# Altium schematic sheet power_supply.SchDoc: Power Supply
size 297 x 209 mm; DrawnBy: TW
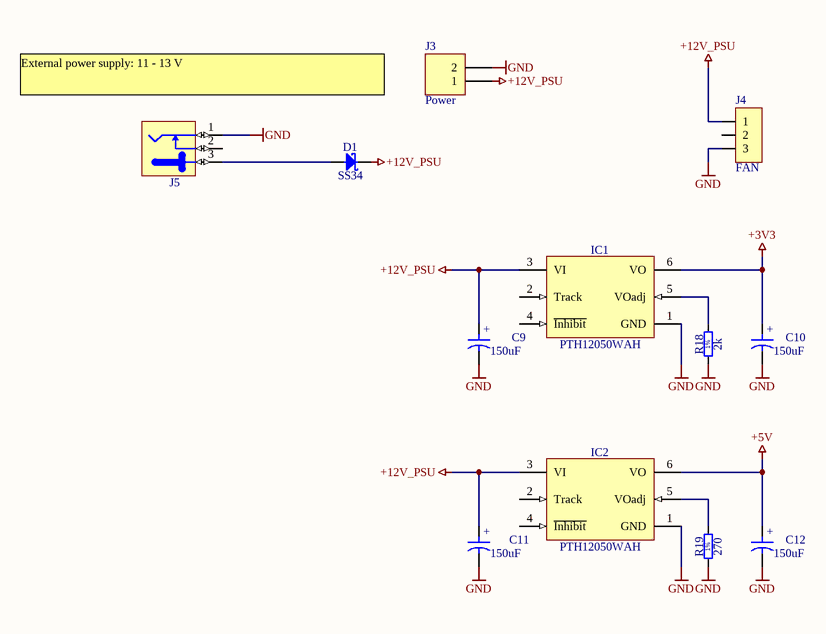
[diagram p0: power_supply.SchDoc]

## Parts
C9  150uF  [CAPPR500-1050X800]
C10  150uF  [CAPPR350-850X700]
C11  150uF  [CAPPR500-1050X800]
C12  150uF  [CAPPR350-850X700]
D1  SS34  [DIOM7659X265N]
IC1  PTH12050WAH  [TEXAS_EUU (R-PDSS-T6)]
IC2  PTH12050WAH  [TEXAS_EUU (R-PDSS-T6)]
J3  Power  [CON_3.96_2]
J4  FAN  [SIP3]
J5  Jack  [LUMBERG_161314]  (value not drawn)
R18  2k  [RESC2012X60N]
R19  270  [RESC2012X60N]

## Nets
+3V3: C10.1 IC1.6(VO)
+5V: C12.1 IC2.6(VO)
+12V_PSU: C9.1 C11.1 D1.1(C) IC1.3(VI) IC2.3(VI) J3.1 J4.1
GND: C9.2 C10.2 C11.2 C12.2 IC1.1(GND) IC2.1(GND) J3.2 J4.3 J5.1 R18.1 R19.1
NetD1_2: D1.2(A) J5.3
NetIC1_5: IC1.5(VOadj) R18.2
NetIC2_5: IC2.5(VOadj) R19.2

Not connected (* = marked no-connect by the designer): IC1 2(Track) 4(~{Inhibit}); IC2 2(Track) 4(~{Inhibit}); J4 2; J5 2

## Notes on the sheet
- (near J5) External power supply: 11 - 13 V
- Project/Equipment
- Document
- Designer
- Drawn by
- Check.by
- File
- Last Mod.
- Print Date
- Sheet
- Size
- A4
- of
- Rev
- (in symbol CAER_150UF_6.3V_20%_SANYO_6SEQP150M) +
- (in symbol CAER_150UF_16V_20%_SANYO_16SEQP150M) +
- (in symbol R0805_2K_1%_0.125W_100PPM) 1%
- (in symbol R0805_270R_1%_0.125W_100PPM) 1%

## Library data of the parts
C9 C11 = CAER_150UF_16V_20%_SANYO_16SEQP150M: Polarised capacitor; Part Description: Aluminium Solid Capacitor With Conductive Polymer (SEQP Serie); Manufacturer: SANYO OS-CON; Voltage: 16V; Tolerance: ±20%; Table: Capacitors THD; Part Number: CAER_150UF_16V_20%_SANYO_16SEQP150M; Component Kind: Standard; Component Type: Standard; Pin Count: 2; Value: 150uF; Status: Not Recommended; Manufacturer Part Number: 16SEQP150M; Case: LS5 D10 x H8; Mounted: Yes; Socket: No; SMD: No; ComponentHeight: 8mm; HelpURL: \\cern.ch\dfs\Applications\Altium\Datasheets\CAER_SANYO_SEQP.pdf; Author: CERN DEM JLC; CreateDate: 3/7/2011; LatestRevisionDate: 3/7/2011
C10 C12 = CAER_150UF_6.3V_20%_SANYO_6SEQP150M: Polarised capacitor; Part Description: Aluminium Solid Capacitor With Conductive Polymer (SEQP Serie); Manufacturer: SANYO OS-CON; Voltage: 6.3V; Tolerance: ±20%; Table: Capacitors THD; Part Number: CAER_150UF_6.3V_20%_SANYO_6SEQP150M; Component Kind: Standard; Component Type: Standard; Pin Count: 2; Value: 150uF; Status: Not Recommended; Manufacturer Part Number: 6SEQP150M; Case: LS3.5 D8 x H7; Mounted: Yes; Socket: No; SMD: No; ComponentHeight: 7mm; HelpURL: \\cern.ch\dfs\Applications\Altium\Datasheets\CAER_SANYO_SEQP.pdf; Author: CERN DEM JLC; CreateDate: 3/7/2011; LatestRevisionDate: 3/7/2011
D1 = SS34: Schottky Diode; Part Description: Surface Mount Schottky Barrier Rectifier; Manufacturer: FAIRCHILD SEMICONDUCTOR; Voltage: 40V; Power: 3A; Table: Diodes; Part Number: SS34; Component Kind: Standard; Component Type: Standard; Device: SS34; PackageDescription: DO-214-AB/SMC Molded Diode, Body 7.95x5.9mm, IPC Medium Density; Manufacturer Part Number: SS34; Pin Count: 2; Case: DO-214AC; Mounted: Yes; Socket: No; SMD: Yes; ComponentHeight: 2.65mm; HelpURL: \\cern.ch\dfs\Applications\Altium\Datasheets\SS34.pdf; Author: CERN DEM JLC; CreateDate: 8/23/2010; LatestRevisionDate: 8/23/2010
IC1 IC2 = PTH12050WAH: 6-A, 12-V Input, Non-Isolated, Wide-Output 1.2V to 5.5V, Adjustable Power Modue; Part Description: 6A, 12-V Input, Non-Isolated, Wide-Output 1.2V to 5.5V, Adjustable Power Module; Manufacturer: TEXAS INSTRUMENTS; Table: Regulators; Part Number: PTH12050WAH; Component Kind: Standard; Component Type: Standard; Device: PTH12050WAH; PackageDescription: Texas TEXAS_EUU (R-PDSS-T6) Case; Manufacturer Part Number: PTH12050WAH; Pin Count: 6; Mounted: Yes; Socket: No; SMD: No; ComponentHeight: 8.5mm; HelpURL: \\cern.ch\dfs\Applications\Altium\Datasheets\PTH12050WAH.pdf; Author: CERN DEM JLC; CreateDate: 7/7/2010; LatestRevisionDate: 7/7/2010
J3 = Header 2: Header, 2-Pin; LatestRevisionDate: 17-Jul-2002; LatestRevisionNote: Re-released for DXP Platform.; Publisher: Altium Limited
J4 = CON3: Connector
J5 = LUMBERG_161314: 24V /3. 5A, 2.1mm Diameter Pin, SMD DC Power Supply Connector With  Break Contact; Manufacturer Part Number: 161314; Table: Miscellaneous; Part Number: LUMBERG_161314; Component Kind: Standard; Component Type: Standard; Pin Count: 3; Family: Jack; Mounted: Yes; Socket: No; SMD: No; Status: None; Part Description: 24V/3. 5A, 2.1mm Diameter Pin, SMD DC Power Supply Connector With  Break Contact; Manufacturer: LUMBERG; ComponentHeight: 11mm; HelpURL: \\cern.ch\dfs\Applications\Altium\Datasheets\LUMBERG_161314.pdf; Author: CERN DEM JLC; CreateDate: 2/15/2011; LatestRevisionDate: 3/2/2011
R18 = R0805_2K_1%_0.125W_100PPM: Resistor - 1%; Part Description: General Purpose Thick Film Chip Resistor; Manufacturer: GENERIC; Manufacturer1 Part Number: NRC10F2001TRF; Power: 0.125W; TC: ±100ppm/°C; Table: Resistors SMD; Part Number: R0805_2K_1%_0.125W_100PPM; Component Kind: Standard; Component Type: Standard; Pin Count: 2; Value: 2k; Status: Preferred; Tolerance: ±1%; Manufacturer Part Number: R0805_2K_1%_0.125W_100PPM; Case: 0805; Mounted: Yes; Socket: No; SMD: Yes; Manufacturer1 Example: NIC COMPONENT; Manufacturer1 ComponentHeight: 0.6mm; HelpURL: \\cern.ch\dfs\Applications\Altium\Datasheets\R0805_NIC_NRC.pdf; Author: CERN DEM JLC; CreateDate: 12/3/2007; LatestRevisionDate: 3/13/2008
R19 = R0805_270R_1%_0.125W_100PPM: Resistor - 1%; Part Description: General Purpose Thick Film Chip Resistor; Manufacturer: GENERIC; Manufacturer1 Part Number: NRC10F2700TRF; Power: 0.125W; TC: ±100ppm/°C; Table: Resistors SMD; Part Number: R0805_270R_1%_0.125W_100PPM; Component Kind: Standard; Component Type: Standard; Pin Count: 2; Value: 270; Status: Preferred; Tolerance: ±1%; Manufacturer Part Number: R0805_270R_1%_0.125W_100PPM; Case: 0805; Mounted: Yes; Socket: No; SMD: Yes; Manufacturer1 Example: NIC COMPONENT; Manufacturer1 ComponentHeight: 0.6mm; HelpURL: \\cern.ch\dfs\Applications\Altium\Datasheets\R0805_NIC_NRC.pdf; Author: CERN DEM JLC; CreateDate: 12/3/2007; LatestRevisionDate: 3/13/2008